# Altium schematic sheet RoboticArmIEEE_Main.SchDoc
size C; SheetNumber: 1; SheetTotal: 1
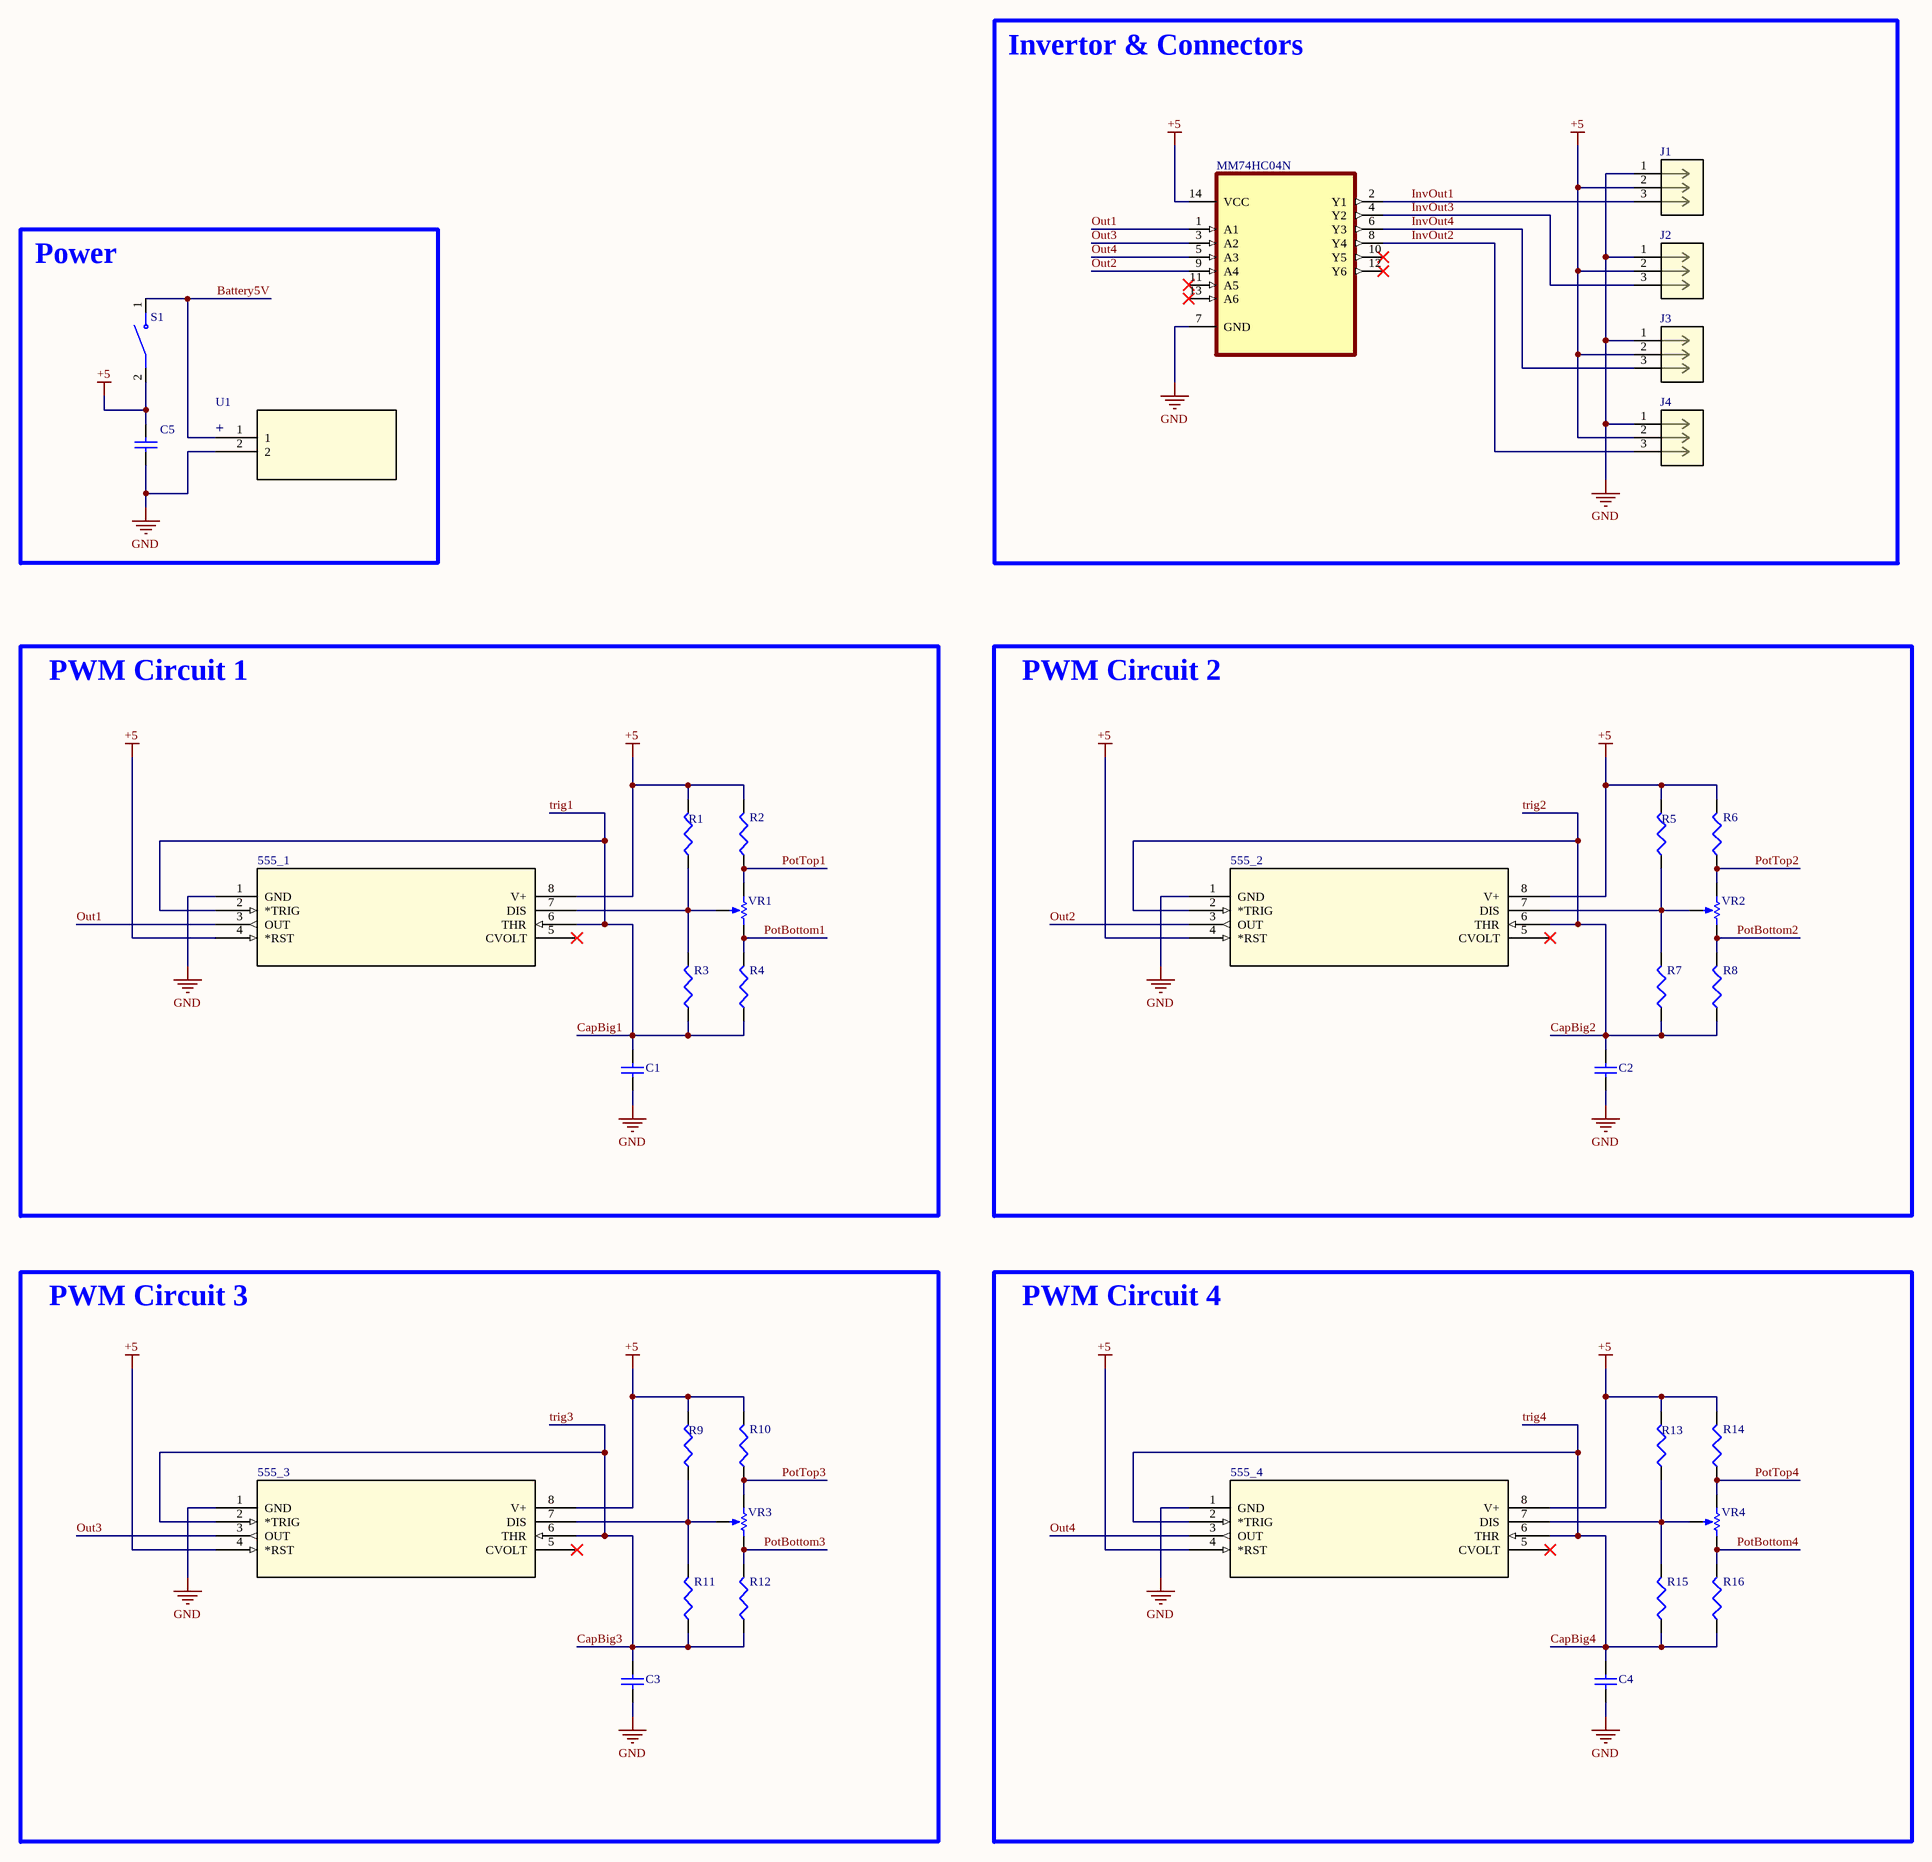
[diagram p0: RoboticArmIEEE_Main.SchDoc]

## Parts
555_1  LMC555CNNOPB  [N08E_TEX]  (value not drawn)
555_2  LMC555CNNOPB  [N08E_TEX]  (value not drawn)
555_3  LMC555CNNOPB  [N08E_TEX]  (value not drawn)
555_4  LMC555CNNOPB  [N08E_TEX]  (value not drawn)
C1  Cap_Big  [Cap_Big]  (value not drawn)
C2  Cap_Big  [Cap_Big]  (value not drawn)
C3  Cap_Big  [Cap_Big]  (value not drawn)
C4  Cap_Big  [Cap_Big]  (value not drawn)
C5  Cap_Small  [Cap_Small]  (value not drawn)
J1  PPTC031LFBN-RC  [CONN_PPTC031_SUL]  (value not drawn)
J2  PPTC031LFBN-RC  [CONN_PPTC031_SUL]  (value not drawn)
J3  PPTC031LFBN-RC  [CONN_PPTC031_SUL]  (value not drawn)
J4  PPTC031LFBN-RC  [CONN_PPTC031_SUL]  (value not drawn)
MM74HC04N  MM74HC04N  [DIP254P762X533-14]  (value not drawn)
R1  R?  [Resistor]  (value not drawn)
R2  Resistor  [Resistor]  (value not drawn)
R3  Resistor  [Resistor]  (value not drawn)
R4  Resistor  [Resistor]  (value not drawn)
R5  R?  [Resistor]  (value not drawn)
R6  Resistor  [Resistor]  (value not drawn)
R7  Resistor  [Resistor]  (value not drawn)
R8  Resistor  [Resistor]  (value not drawn)
R9  R?  [Resistor]  (value not drawn)
R10  Resistor  [Resistor]  (value not drawn)
R11  Resistor  [Resistor]  (value not drawn)
R12  Resistor  [Resistor]  (value not drawn)
R13  R?  [Resistor]  (value not drawn)
R14  Resistor  [Resistor]  (value not drawn)
R15  Resistor  [Resistor]  (value not drawn)
R16  Resistor  [Resistor]  (value not drawn)
S1  GF-123-0054  [SW_GF-123-0054]  (value not drawn)
U1  2479  [2479PCB_37P49X52P63_KEY]  (value not drawn)
VR1  P160KNPD-2QC25B2K  [IC3_P160KNPD-2QC25B2K_BIT]  (value not drawn)
VR2  P160KNPD-2QC25B2K  [IC3_P160KNPD-2QC25B2K_BIT]  (value not drawn)
VR3  P160KNPD-2QC25B2K  [IC3_P160KNPD-2QC25B2K_BIT]  (value not drawn)
VR4  P160KNPD-2QC25B2K  [IC3_P160KNPD-2QC25B2K_BIT]  (value not drawn)

## Blocks framed on the sheet
Invertor & Connectors: J1-J4 MM74HC04N
Power: C5 S1 U1
PWM Circuit 1: 555_1 C1 R1-R4 VR1
PWM Circuit 2: 555_2 C2 R5-R8 VR2
PWM Circuit 3: 555_3 C3 R9-R12 VR3
PWM Circuit 4: 555_4 C4 R13-R16 VR4

## Nets
+5: 555_1.4(*RST) 555_1.8(V+) 555_2.4(*RST) 555_2.8(V+) 555_3.4(*RST) 555_3.8(V+) 555_4.4(*RST) 555_4.8(V+) C5.2 J1.2 J2.2 J3.2 J4.2 MM74HC04N.14(VCC) R1.2 R2.2 R5.2 R6.2 R9.2 R10.2 R13.2 R14.2 S1.2
GND: 555_1.1(GND) 555_2.1(GND) 555_3.1(GND) 555_4.1(GND) C1.1 C2.1 C3.1 C4.1 C5.1 J1.1 J2.1 J3.1 J4.1 MM74HC04N.7(GND) U1.2
Battery5V: S1.1 U1.1
CapBig1: 555_1.2(*TRIG) 555_1.6(THR) C1.2 R3.1 R4.1  [also labelled trig1]
CapBig2: 555_2.2(*TRIG) 555_2.6(THR) C2.2 R7.1 R8.1  [also labelled trig2]
CapBig3: 555_3.2(*TRIG) 555_3.6(THR) C3.2 R11.1 R12.1  [also labelled trig3]
CapBig4: 555_4.2(*TRIG) 555_4.6(THR) C4.2 R15.1 R16.1  [also labelled trig4]
InvOut1: J1.3 MM74HC04N.2(Y1)
InvOut2: J4.3 MM74HC04N.8(Y4)
InvOut3: J2.3 MM74HC04N.4(Y2)
InvOut4: J3.3 MM74HC04N.6(Y3)
Out1: 555_1.3(OUT) MM74HC04N.1(A1)
Out2: 555_2.3(OUT) MM74HC04N.9(A4)
Out3: 555_3.3(OUT) MM74HC04N.3(A2)
Out4: 555_4.3(OUT) MM74HC04N.5(A3)
PotBottom1: R4.2 VR1.1(CW)
PotBottom2: R8.2 VR2.1(CW)
PotBottom3: R12.2 VR3.1(CW)
PotBottom4: R16.2 VR4.1(CW)
PotTop1: R2.1 VR1.3(CCW)
PotTop2: R6.1 VR2.3(CCW)
PotTop3: R10.1 VR3.3(CCW)
PotTop4: R14.1 VR4.3(CCW)
Net555_1_7: 555_1.7(DIS) R1.1 R3.2 VR1.2(S)
Net555_2_7: 555_2.7(DIS) R5.1 R7.2 VR2.2(S)
Net555_3_7: 555_3.7(DIS) R9.1 R11.2 VR3.2(S)
Net555_4_7: 555_4.7(DIS) R13.1 R15.2 VR4.2(S)

Not connected (* = marked no-connect by the designer): 555_1 5(CVOLT)*; 555_2 5(CVOLT)*; 555_3 5(CVOLT)*; 555_4 5(CVOLT)*; MM74HC04N 10(Y5)* 11(A5)* 12(Y6)* 13(A6)*

## Notes on the sheet
- (in symbol 2479) +

## Library data of the parts
555_1-555_4 = LMC555CNNOPB: No Description Available; Mfr_Name: Texas Instruments; RefDes: RefDes; Type: Type
J1-J4 = PPTC031LFBN-RC: No Description Available; Mfr_Name: Sullins; RefDes: RefDes; Type: Type
MM74HC04N = CMP-016-00010-1: Inverter IC 6 Channel 14-PDIP; MF: ON Semiconductor; Case/Package: PDIP-14 ON Semiconductor; Value: *; Price: None; SnapEDA_Link: https://www.snapeda.com/parts/MM74HC04N/ON%20Semiconductor/view-part/2081914/?ref=snap; Source: SnapEDAsch.SchLib; Availability: Unavailable; Component Type: Standard; Design Item ID: MM74HC04N; Pins: 14; MP: MM74HC04N
R1 R5 R9 R13 = Resistor
S1 = GF-123-0054: Slide Switch SPST Through Hole; Package: None; MP: GF-123-0054; Value: *; Availability: Unavailable; Price: None
U1 = 2479: No Description Available; Mfr_Name: Keystone Electronics; RefDes: RefDes; Type: Type
VR1-VR4 = P160KNPD-2QC25B2K: No Description Available; Mfr_Name: TT Electronics / BI Technologies; RefDes: RefDes; Type: Type